# Altium project CAMA001AA-Project.PrjPCB (part 2 of 2)

## Sheet Power-V1_0.SchDoc
size A4; Organization: VAEngineering; Address1: Rechtstro 1 bus 2; Address2: 9185 Wachtebeke; Address3: Belgium; Revision: REV0; SheetNumber: 1; SheetTotal: 5
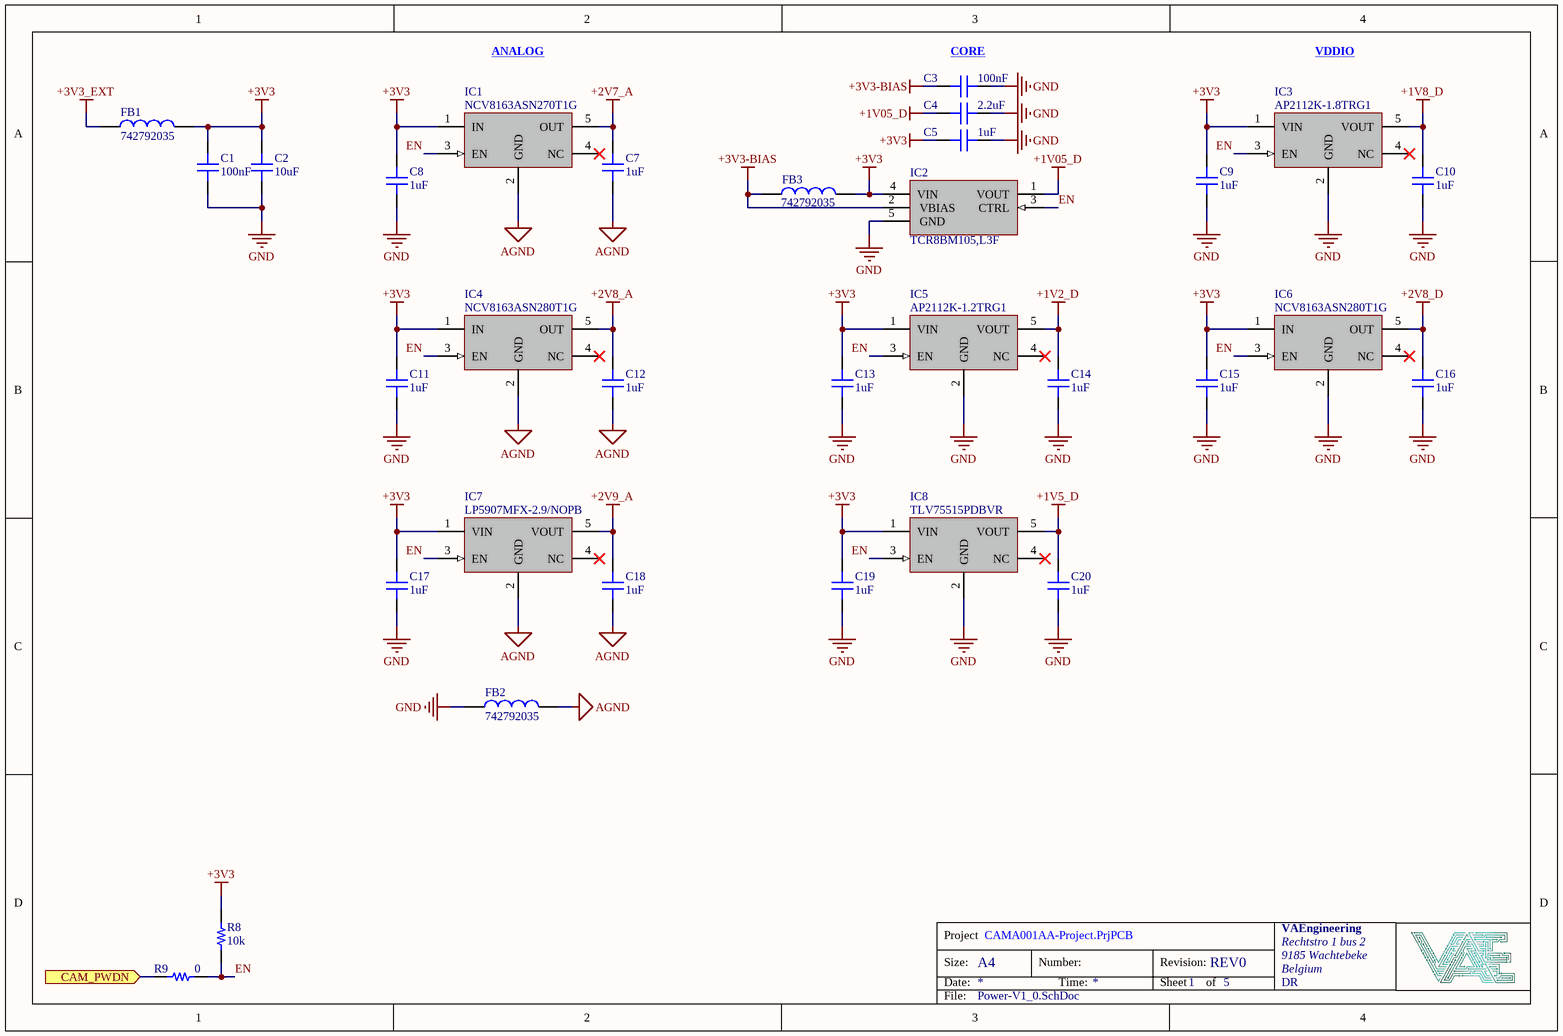
[diagram p1: Power-V1_0.SchDoc]

### Parts
C1  Capacitance: 100nF  [Esmart C0603]  (hidden comment: CL10B104KB8NNNL)
C2  Capacitance: 10uF  [ESmart C0805]  (hidden comment: CL21A106KOQNNWE)
C3  Capacitance: 100nF  [Esmart C0603]  (hidden comment: CL10B104KB8NNNL)
C4  Capacitance: 2.2uF  [ESMART C0603]  (hidden comment: LMK107B7225KA-TR)
C5  Capacitance: 1uF  [ESmart C0603 - Samsung]  (hidden comment: CL10A105KB8NNNC)
C7  Capacitance: 1uF  [ESmart C0603 - Samsung]  (hidden comment: CL10A105KB8NNNC)
C8  Capacitance: 1uF  [ESmart C0603 - Samsung]  (hidden comment: CL10A105KB8NNNC)
C9  Capacitance: 1uF  [ESmart C0603 - Samsung]  (hidden comment: CL10A105KB8NNNC)
C10  Capacitance: 1uF  [ESmart C0603 - Samsung]  (hidden comment: CL10A105KB8NNNC)
C11  Capacitance: 1uF  [ESmart C0603 - Samsung]  (hidden comment: CL10A105KB8NNNC)
C12  Capacitance: 1uF  [ESmart C0603 - Samsung]  (hidden comment: CL10A105KB8NNNC)
C13  Capacitance: 1uF  [ESmart C0603 - Samsung]  (hidden comment: CL10A105KB8NNNC)
C14  Capacitance: 1uF  [ESmart C0603 - Samsung]  (hidden comment: CL10A105KB8NNNC)
C15  Capacitance: 1uF  [ESmart C0603 - Samsung]  (hidden comment: CL10A105KB8NNNC)
C16  Capacitance: 1uF  [ESmart C0603 - Samsung]  (hidden comment: CL10A105KB8NNNC)
C17  Capacitance: 1uF  [ESmart C0603 - Samsung]  (hidden comment: CL10A105KB8NNNC)
C18  Capacitance: 1uF  [ESmart C0603 - Samsung]  (hidden comment: CL10A105KB8NNNC)
C19  Capacitance: 1uF  [ESmart C0603 - Samsung]  (hidden comment: CL10A105KB8NNNC)
C20  Capacitance: 1uF  [ESmart C0603 - Samsung]  (hidden comment: CL10A105KB8NNNC)
FB1  742792035  [Wurth WE-CBF_0805_High Speed]
FB2  742792035  [Wurth WE-CBF_0805_High Speed]
FB3  742792035  [Wurth WE-CBF_0805_High Speed]
IC1  NCV8163ASN270T1G  [ON Semi TSOP-5 / CASE 483 / ISSUE M]
IC2  TCR8BM105,L3F  [Toshiba DFN5B]
IC3  AP2112K-1.8TRG1  [DIODES SOT-25]
IC4  NCV8163ASN280T1G  [ON Semi TSOP-5 / CASE 483 / ISSUE M]
IC5  AP2112K-1.2TRG1  [DIODES SOT-23-5 W5]
IC6  NCV8163ASN280T1G  [ON Semi TSOP-5 / CASE 483 / ISSUE M]
IC7  LP5907MFX-2.9/NOPB  [TI SOT-23-5 / DBV0005A]
IC8  TLV75515PDBVR  [TI SOT-23-5 / DBV0005A]
R8  Resistance: 10k  [ESmart R0603]  (hidden comment: RMCF0603FT10K0)
R9  Resistance: 0  [ESmart R0603]  (hidden comment: RMCF0603ZT0R00)

### Ports
CAM_PWDN (in)

### Nets
+1V2_D: C14.1 IC5.5(VOUT)
+1V05_D: C4.1 IC2.1(VOUT)
+1V5_D: C20.1 IC8.5(VOUT)
+1V8_D: C10.1 IC3.5(VOUT)
+2V7_A: C7.1 IC1.5(OUT)
+2V8_A: C12.1 IC4.5(OUT)
+2V8_D: C16.1 IC6.5(OUT)
+2V9_A: C18.1 IC7.5(VOUT)
+3V3: C1.2 C2.2 C5.1 C8.1 C9.1 C11.1 C13.1 C15.1 C17.1 C19.1 FB1.1 FB3.1 IC1.1(IN) IC2.4(VIN) IC3.1(VIN) IC4.1(IN) IC5.1(VIN) IC6.1(IN) IC7.1(VIN) IC8.1(VIN) R8.1
+3V3-BIAS: C3.1 FB3.2 IC2.2(VBIAS)
+3V3_EXT: FB1.2
AGND: C7.2 C12.2 C18.2 FB2.2 IC1.2(GND) IC4.2(GND) IC7.2(GND)
GND: C1.1 C2.1 C3.2 C4.2 C5.2 C8.2 C9.2 C10.2 C11.2 C13.2 C14.2 C15.2 C16.2 C17.2 C19.2 C20.2 FB2.1 IC2.5(GND) IC3.2(GND) IC5.2(GND) IC6.2(GND) IC8.2(GND)
CAM_PWDN: R9.1 ; port CAM_PWDN
EN: IC1.3(EN) IC2.3(CTRL) IC3.3(EN) IC4.3(EN) IC5.3(EN) IC6.3(EN) IC7.3(EN) IC8.3(EN) R8.2 R9.2

Not connected (* = marked no-connect by the designer): IC1 4(NC)*; IC3 4(NC)*; IC4 4(NC)*; IC5 4(NC)*; IC6 4(NC)*; IC7 4(NC)*; IC8 4(NC)*

### Notes on the sheet
- ANALOG
- (near C3) CORE
- VDDIO
- Project
- Size:
- Date:
- A4
- Number:
- Time:
- Revision:
- Sheet
- of
- File:

### Library data of the parts
C1 C3 = Samsung CL10B104KB8NNNL: CL10 Series 0603 0.1 uF 50 V ±10% Tolerance X7R Multilayer Ceramic Capacitor; Voltage Rating: 50V; Supplier 1: Digi-Key; Manufacturer: Samsung; Manufacturer Part Number: CL10B104KB8NNNL; RoHS: Yes; Category: Ceramic Capacitors; Stock 1: 359524; Pricing 1: 1=0,10000, 10=0,02900, 50=0,01580, 100=0,01280, 500=0,00916, 1000=0,00720, 2500=0,00654, 5000=0,00602 (USD); Mount: Surface Mount; Case/Package: 0603; Min Operating Temperature: -55°C; Max Operating Temperature: 125°C; Tolerance: 10%; Dielectric: X7R; Packaging: Tape and Reel; Package Quantity: 15000; Voltage Rating (DC): 50V; Length: 1.6mm; Width: 0.031inch; Height: 0.8mm; Thickness: 0.035inch; Depth: 0.8mm; Radiation Hardening: No; ComponentLink1URL: https://datasheet.ciiva.com/26838/getdatasheetpartid-357523-26838415.pdf?src-supplier=Verical; ComponentLink1Description: https://datasheet.ciiva.com/26838/getdatasheetpartid-357523-26838415.pdf?src-supplier=Verical; ComponentLink2URL: https://datasheet.ciiva.com/25741/cl10b104kb8nnnl-25741341.pdf?src-supplier=Digi-Key; ComponentLink2Description: https://datasheet.ciiva.com/25741/cl10b104kb8nnnl-25741341.pdf?src-supplier=Digi-Key; Supplier 2: Digi-Key; Stock 2: 359524; Pricing 2: 1=0,10000, 10=0,02900, 50=0,01580, 100=0,01280, 500=0,00916, 1000=0,00720, 2500=0,00654, 5000=0,00602 (USD); Supplier 3: Digi-Key; Stock 3: 359524; Pricing 3: 15000=0,00524, 30000=0,00497, 75000=0,00445, 105000=0,00360, 150000=0,00348, 375000=0,00314 (USD); Supplier 4: Future Electronics; Stock 4: 1530651; Pricing 4: 1=0,09800, 1000=0,01180, 2500=0,00890, 5000=0,00720, 10000=0,00580 (USD); Supplier 5: Future Electronics; Stock 5: 1530000; Pricing 5: 15000=0,00370, 45000=0,00310, 75000=0,00310, 225000=0,00300, 375000=0,00300 (USD); Supplier 6: Avnet; Stock 6: 1008000; Pricing 6: 15000=0,00264, 30000=0,00261, 60000=0,00259, 90000=0,00257, 120000=0,00255 (USD); Supplier 7: Mouser; Stock 7: 480000; Pricing 7: 15000=0,00500, 45000=0,00500 (USD); Supplier 8: Arrow Electronics; Stock 8: 180000; Pricing 8: 15000=0,00350, 1=0,02810, 10=0,02460, 25=0,02430, 100=0,02310, 250=0,02280, 500=0,02250, 1000=0,01640, 3000=0,01480, 6000=0,01360, 15000=0,00950 (USD); Supplier 9: Digi-Key; Supplier 10: Future Electronics; Supplier 11: Future Electronics; Supplier Part Number 1: 1276-CL10B104KB8NNNLCT-ND; Supplier Part Number 2: 1276-CL10B104KB8NNNLDKR-ND; Supplier Part Number 3: 1276-CL10B104KB8NNNLTR-ND; Supplier Part Number 4: 3113240; Supplier Part Number 5: 1051215; Supplier Part Number 6: CL10B104KB8NNNL; Supplier Part Number 7: 187-CL10B104KB8NNNL; Supplier Part Number 8: CL10B104KB8NNNL; Supplier Part Number 9: CL10B104KB8NNNL-ND; Supplier Part Number 10: CL10B104KB8NNNL-REEL; Supplier Part Number 11: CL10B104KB8NNNL-CUTT
C2 = Sasmung CL21A106KOQNNWE: CAP CER 10UF 16V X5R 0805; Manufacturer: Samsung; Tolerance: 10%; Supplier 1: Digi-Key; Manufacturer Part Number: CL21A106KOQNNWE; RoHS: Yes; Category: Ceramic Capacitors; Stock 1: 76074; Pricing 1: 1=0,13000, 10=0,09300, 50=0,05280, 100=0,04370, 500=0,03064, 1000=0,02536 (USD); Mount: Surface Mount; Case/Package: 0805; Case Code (Metric): 2012; Case Code (Imperial): 0805; Min Operating Temperature: -55°C; Max Operating Temperature: 85°C; Package Quantity: 1; Packaging: Tape and Reel; Voltage Rating: 16V; Length: 0.079inch; Width: 0.049inch; Thickness: 0.055inch; ComponentLink1URL: https://datasheet.ciiva.com/25730/cl21a106koqnnwe-25730257.pdf?src-supplier=Digi-Key; ComponentLink1Description: https://datasheet.ciiva.com/25730/cl21a106koqnnwe-25730257.pdf?src-supplier=Digi-Key; Supplier 2: Digi-Key; Stock 2: 76074; Pricing 2: 1=0,13000, 10=0,09300, 50=0,05280, 100=0,04370, 500=0,03064, 1000=0,02536 (USD); Supplier 3: Digi-Key; Stock 3: 74000; Pricing 3: 2000=0,02360, 4000=0,02159, 10000=0,02009, 14000=0,01908, 50000=0,01657 (USD); Supplier 4: Mouser; Stock 4: 174000; Pricing 4: 1=0,14000, 10=0,10200, 100=0,04800, 500=0,03300, 1000=0,02700, 2000=0,02300, 10000=0,02000, 50000=0,01700 (USD); Supplier 5: Arrow Electronics; Stock 5: 7; Pricing 5: 1=0,08030 (USD); Supplier 6: Avnet; Pricing 6: 200000=0,01179, 204000=0,01162, 404000=0,01129, 1000000=0,01104, 2000000=0,01062 (USD); Supplier 7: Future Electronics; Pricing 7: 1=0,16700, 50=0,06610, 100=0,05610, 250=0,04520, 500=0,03840 (USD); Supplier 8: Future Electronics; Pricing 8: 2000=0,02900, 8000=0,01610, 20000=0,01510, 50000=0,01420, 80000=0,01380 (USD); Supplier 9: Future Electronics; Supplier 10: Future Electronics; Supplier Part Number 1: 1276-2894-1-ND; Supplier Part Number 2: 1276-2894-6-ND; Supplier Part Number 3: 1276-2894-2-ND; Supplier Part Number 4: 187-CL21A106KOQNNWE; Supplier Part Number 5: CL21A106KOQNNWE; Supplier Part Number 6: CL21A106KOQNNWE; Supplier Part Number 7: 4114733; Supplier Part Number 8: 5114029; Supplier Part Number 9: CL21A106KOQNNWE-CUTT; Supplier Part Number 10: CL21A106KOQNNWE-REEL
C4 = Taiyo Yuden LMK107B7225KA-TR: 0603 2.2 uF 10 V ±10 % Tolerance X7R Surface Mount Multilayer Ceramic Capacitor; Voltage Rating: 10V; Tolerance: 10%; Supplier 1: Digi-Key; Manufacturer: Taiyo Yuden; Manufacturer Part Number: LMK107B7225KA-TR; RoHS: Yes; Category: Ceramic Capacitors; Stock 1: 1165; Pricing 1: 1=0,20000, 10=0,13800, 50=0,08280, 100=0,06990, 500=0,04784, 1000=0,04232 (USD); Mount: Surface Mount; Case/Package: 0603; Min Operating Temperature: -55°C; Max Operating Temperature: 125°C; Packaging: Tape and Reel; Voltage Rating (DC): 10V; Dielectric: X7R; Termination: Wraparound; Length: 0.063inch; Width: 0.031inch; Thickness: 0.035inch; RoHS Compliant: Yes; Halogen Free: Halogen Free; ComponentLink1URL: http://www.yuden.co.jp/productdata/catalog/en/mlcc_all_e.pdf?src-supplier=Digi-Key; ComponentLink1Description: http://www.yuden.co.jp/productdata/catalog/en/mlcc_all_e.pdf?src-supplier=Digi-Key; ComponentLink2URL: https://www.yuden.co.jp/productdata/catalog/mlcc01_e.pdf?src-supplier=Digi-Key; ComponentLink2Description: https://www.yuden.co.jp/productdata/catalog/mlcc01_e.pdf?src-supplier=Digi-Key; ComponentLink3URL: http://www.yuden.co.jp/productdata/catalog/en/mlcc_all_e.pdf?src-supplier=Avnet+Asia; ComponentLink3Description: http://www.yuden.co.jp/productdata/catalog/en/mlcc_all_e.pdf?src-supplier=Avnet+Asia; Supplier 2: Digi-Key; Stock 2: 1165; Pricing 2: 1=0,20000, 10=0,13800, 50=0,08280, 100=0,06990, 500=0,04784, 1000=0,04232 (USD); Supplier 3: Newark; Stock 3: 60000; Pricing 3: 1=0,01900, 4000=0,01900, 8000=0,01900, 16000=0,01900, 24000=0,01900 (USD); Supplier 4: Newark; Stock 4: 8000; Pricing 4: 1=0,03600, 4000=0,03500, 8000=0,03300, 16000=0,02500, 24000=0,02300 (USD); Supplier 5: RSComponents; Stock 5: 1; Pricing 5: 4000=0,03800 (USD); Supplier 6: Avnet; Stock 6: 8000; Pricing 6: 4000=0,03472, 8000=0,03280, 16000=0,03088, 24000=0,02082, 32000=0,01944, 40000=0,01806, 400000=0,01450 (USD); Supplier 7: Future Electronics; Stock 7: 4000; Pricing 7: 4000=0,06000 (USD); Supplier 8: Newark; Pricing 8: 1=0,22000, 25=0,15200, 50=0,11400, 100=0,07600, 250=0,06400, 500=0,05200, 4000=0,05200 (USD); Supplier 9: Avnet; Pricing 9: 4000=0,03400, 8000=0,03300, 16000=0,02500, 24000=0,02300 (USD); Supplier 10: Mouser; Pricing 10: 1=0,18000, 10=0,11600, 50=0,11600, 100=0,06700, 500=0,04800, 1000=0,04300, 4000=0,03500, 8000=0,03300, 10000=0,03300 (USD); Supplier 11: Digi-Key; Pricing 11: 4000=0,03680 (USD); Supplier 12: RSComponents; Supplier 13: RSComponents; Supplier 14: Arrow Electronics; Supplier 15: Digi-Key; Supplier Part Number 1: 587-5914-1-ND; Supplier Part Number 2: 587-5914-6-ND; Supplier Part Number 3: 68X1539; Supplier Part Number 4: 79AH3598; Supplier Part Number 5: 1843193; Supplier Part Number 6: LMK107B7225KA-TR; Supplier Part Number 7: 2054571; Supplier Part Number 8: 02AH5379; Supplier Part Number 9: 68X1539; Supplier Part Number 10: 963-LMK107B7225KA-TR; Supplier Part Number 11: 587-5914-2-ND; Supplier Part Number 12: 1843774; Supplier Part Number 13: 1843774P; Supplier Part Number 14: LMK107B7225KA-TR**MULT1; Supplier Part Number 15: LMK107B7225KA-TR-ND
C5 C7-C20 = Samsung CL10A105KB8NNNC: Cap Ceramic 1uF 50V X5R 10% SMD 0603 85C Cardboard T/R; Supplier 1: Digi-Key; Manufacturer: Samsung; Manufacturer Part Number: CL10A105KB8NNNC; RoHS: Yes; Category: Ceramic Capacitors; Stock 1: 1933508; Pricing 1: 1=0,16000, 10=0,11500, 50=0,06560, 100=0,05430, 500=0,03808, 1000=0,03152 (USD); Mount: Surface Mount; Case/Package: 0603; Case Code (Imperial): 0603; Case Code (Metric): 1608; Contact Plating: Tin; Min Operating Temperature: -55°C; Max Operating Temperature: 85°C; Package Quantity: 1; Packaging: Tape and Reel; Tolerance: 10%; Voltage Rating: 50V; Dielectric: X5R; Termination: Wraparound; Length: 1.6mm; Width: 0.031inch; Thickness: 0.035inch; Depth: 0.8mm; Radiation Hardening: No; ComponentLink1URL: https://datasheet.ciiva.com/26877/getdatasheetpartid-753736-26877879.pdf?src-supplier=Verical; ComponentLink1Description: https://datasheet.ciiva.com/26877/getdatasheetpartid-753736-26877879.pdf?src-supplier=Verical; Supplier 2: Digi-Key; Stock 2: 1933508; Pricing 2: 1=0,16000, 10=0,11500, 50=0,06560, 100=0,05430, 500=0,03808, 1000=0,03152 (USD); Supplier 3: Digi-Key; Stock 3: 1933508; Pricing 3: 4000=0,02441, 8000=0,02270, 12000=0,02157, 28000=0,02043, 100000=0,01547 (USD); Supplier 4: Newark; Stock 4: 132000; Pricing 4: 1=0,02600, 4000=0,02500, 8000=0,02400, 16000=0,02300 (USD); Supplier 5: Newark; Stock 5: 4312; Pricing 5: 1=0,19200, 25=0,13800, 50=0,07800, 100=0,06500, 250=0,05500, 500=0,04600, 1000=0,03700 (USD); Supplier 6: Avnet; Stock 6: 116000; Pricing 6: 4000=0,02554, 8000=0,02298, 16000=0,02158, 24000=0,02155, 32000=0,02055 (USD); Supplier 7: Future Electronics; Stock 7: 45790; Pricing 7: 1=0,16700, 50=0,06930, 100=0,05930, 500=0,04130, 1500=0,03230 (USD); Supplier 8: Future Electronics; Stock 8: 44000; Pricing 8: 4000=0,02140, 12000=0,01780, 20000=0,01760, 40000=0,01730, 80000=0,01710 (USD); Supplier 9: Arrow Electronics; Stock 9: 8000; Pricing 9: 4000=0,02400, 8000=0,02240, 12000=0,02050, 28000=0,01910, 100000=0,01640, 1=0,10010 (USD); Supplier 10: Mouser; Stock 10: 218690; Pricing 10: 1=0,16000, 10=0,11500, 100=0,05400, 500=0,03800, 1000=0,03100, 2500=0,02400, 8000=0,02100, 24000=0,02000 (USD); Supplier 11: Farnell; Stock 11: 19232; Pricing 11: 10=0,06830, 100=0,05540, 500=0,03430, 1000=0,02560, 2000=0,02160, 4000=0,01750, 20000=0,01490 (GBP); Supplier 12: Farnell; Pricing 12: 150=0,05540, 500=0,03430, 1000=0,02560, 2000=0,02160, 4000=0,01750, 20000=0,01490 (GBP); Supplier 13: Farnell; Pricing 13: 4000=0,01750, 20000=0,01600 (GBP); Supplier 14: Newark; Supplier 15: Farnell; Supplier 16: Future Electronics; Supplier 17: Future Electronics; Supplier Part Number 1: 1276-1860-1-ND; Supplier Part Number 2: 1276-1860-6-ND; Supplier Part Number 3: 1276-1860-2-ND; Supplier Part Number 4: 82AC9278; Supplier Part Number 5: 82AC9277; Supplier Part Number 6: CL10A105KB8NNNC; Supplier Part Number 7: 1025631; Supplier Part Number 8: 7019721; Supplier Part Number 9: CL10A105KB8NNNC; Supplier Part Number 10: 187-CL10A105KB8NNNC; Supplier Part Number 11: 3013383; Supplier Part Number 12: 3013383RL; Supplier Part Number 13: 3010057; Supplier Part Number 14: 42AH1669; Supplier Part Number 15: 2988817; Supplier Part Number 16: CL10A105KB8NNNC-CUTT; Supplier Part Number 17: CL10A105KB8NNNC-REEL
FB1-FB3 = Wurth 742792035: Ferrite Beads WE-CBF 0805 220MHz 300Ohm 300mA; Manufacturer: Wurth Electronics; Resistance: 300mR; Tolerance: 25%; Impedance: 300R; Number of Lines: 1; Inductance: 470nH; Manufacturer Part Number: 742792035; RoHS: Yes; Category: Ferrite Beads and Chips; Stock 1: 8037; Pricing 1: 1=0,20000, 50=0,19600, 100=0,18000, 500=0,17200, 1000=0,16500, 2000=0,15700 (USD); Mount: Surface Mount; Case/Package: SMD/SMT; Core Material: Ferrite; Case Code (Metric): 2012; Case Code (Imperial): 0805; Weight: 0.000194oz; Material: Ferrite; Min Operating Temperature: -55°C; Max Operating Temperature: 125°C; Package Quantity: 4000; Packaging: Tape and Reel; Current Rating: 300mA; Max Current Rating: 300mA; DC Resistance (DCR): 300mR; Max DC Current: 300mA; Termination: SMD/SMT; Test Frequency: 220MHz; Series: WE-CBF; Length: 2mm; Width: 0.047inch; Height: 0.9mm; Depth: 1.2mm; REACH SVHC: Unknown; RoHS Compliant: Yes; ComponentLink1URL: https://datasheet.ciiva.com/1474/1696023-1474913.pdf?src-supplier=Farnell; ComponentLink1Description: https://datasheet.ciiva.com/1474/1696023-1474913.pdf?src-supplier=Farnell; ComponentLink2URL: https://datasheet.ciiva.com/23762/742792035-23762913.pdf?src-supplier=Newark; ComponentLink2Description: https://datasheet.ciiva.com/23762/742792035-23762913.pdf?src-supplier=Newark; ComponentLink3URL: https://datasheet.ciiva.com/11803/0900766b80d2dd7e-11803674.pdf?src-supplier=RSComponents; ComponentLink3Description: https://datasheet.ciiva.com/11803/0900766b80d2dd7e-11803674.pdf?src-supplier=RSComponents; ComponentLink4URL: https://datasheet.ciiva.com/1126/1696023-1126566.pdf?src-supplier=Element14; ComponentLink4Description: https://datasheet.ciiva.com/1126/1696023-1126566.pdf?src-supplier=Element14; ComponentLink5URL: https://datasheet.ciiva.com/29363/742792035-29363979.pdf?src-supplier=Digi-Key; ComponentLink5Description: https://datasheet.ciiva.com/29363/742792035-29363979.pdf?src-supplier=Digi-Key; ComponentLink6URL: https://datasheet.ciiva.com/14122/742792035-eng-tds-14122796.pdf?src-supplier=Distrelec; ComponentLink6Description: https://datasheet.ciiva.com/14122/742792035-eng-tds-14122796.pdf?src-supplier=Distrelec; ComponentLink7URL: https://datasheet.ciiva.com/29363/742792035-29363981.pdf?src-supplier=Digi-Key; ComponentLink7Description: https://datasheet.ciiva.com/29363/742792035-29363981.pdf?src-supplier=Digi-Key; Supplier 1: Digi-Key; Supplier 2: Digi-Key; Supplier 3: Digi-Key; Supplier 4: Mouser; Supplier 5: Farnell; Supplier 6: Farnell; Supplier 7: Farnell; Supplier 8: Newark; Supplier 9: Newark; Supplier 10: RSComponents; Supplier 11: RSComponents; Supplier 12: RSComponents; Supplier 13: Allied Electronics; Supplier Part Number 1: 732-4640-1-ND; Supplier Part Number 2: 732-4640-6-ND; Supplier Part Number 3: 732-4640-2-ND; Supplier Part Number 4: 710-742792035; Supplier Part Number 5: 1635715; Supplier Part Number 6: 1635715RL; Supplier Part Number 7: 2761562; Supplier Part Number 8: 08P2368; Supplier Part Number 9: 24AC5587; Supplier Part Number 10: 1633535; Supplier Part Number 11: 6694068; Supplier Part Number 12: 6694068P; Supplier Part Number 13: 70996351
IC1 = ON Semi NCV8163ASN270T1G: LDO Regulator Pos 2.7V 0.25A Automotive 5-Pin TSOP T/R; Manufacturer: ON Semiconductor; Supplier 1: Avnet; Manufacturer Part Number: NCV8163ASN270T1G; RoHS: Yes; Category: Voltage Regulators - Linear; Stock 1: 108000; Pricing 1: 1225=0,30207, 1300=0,2939, 2500=0,28574, 6200=0,27758, 13000=0,26941, 62000=0,26125, 130000=0,25308 (USD); RoHS Compliant: Yes; ComponentLink1URL: http://www.onsemi.com/pub/Collateral/NCV8163-D.PDF?src-supplier=Digi-Key; ComponentLink1Description: http://www.onsemi.com/pub/Collateral/NCV8163-D.PDF?src-supplier=Digi-Key; Supplier 2: Digi-Key; Stock 2: 5448; Pricing 2: 1=0,77, 10=0,68, 25=0,6392, 100=0,4844, 250=0,41228, 500=0,39166, 1000=0,2989 (USD); Supplier 3: Digi-Key; Stock 3: 5448; Pricing 3: 1=0,77, 10=0,68, 25=0,6392, 100=0,4844, 250=0,41228, 500=0,39166, 1000=0,2989 (USD); Supplier 4: Digi-Key; Stock 4: 3000; Pricing 4: 3000=0,27829, 6000=0,26798, 15000=0,25768, 30000=0,25355 (USD); Supplier 5: Mouser; Stock 5: 2985; Pricing 5: 1=0,77, 10=0,64, 50=0,64, 100=0,413, 1000=0,299, 10000=0,257 (USD); Supplier 6: Heisener; Stock 6: 5253; Pricing 6: 1=0,3356 (USD); Supplier Part Number 1: NCV8163ASN270T1G; Supplier Part Number 2: 488-NCV8163ASN270T1GCT-ND; Supplier Part Number 3: 488-NCV8163ASN270T1GDKR-ND; Supplier Part Number 4: 488-NCV8163ASN270T1GTR-ND; Supplier Part Number 5: 863-NCV8163ASN270T1G; Supplier Part Number 6: NCV8163ASN270T1G
IC2 = Toshiba TCR8BM105,L3F: Low Drop-Out Regulator Positive 1.05V 800mA 5-Pin DFN-B; Supplier 1: Mouser; Manufacturer: Toshiba; Manufacturer Part Number: TCR8BM105,L3F; RoHS: No; Category: Uncategorized; Stock 1: 4989; Pricing 1: 1=0,45000, 10=0,36100, 50=0,36100, 100=0,26800, 1000=0,17600, 10000=0,14800 (USD); Supplier 2: Digi-Key; Stock 2: 4994; Pricing 2: 1=0,45000, 10=0,38600, 25=0,36040, 100=0,28840, 250=0,26780, 500=0,22660, 1000=0,17510, 2500=0,15965 (USD); Supplier 3: Digi-Key; Stock 3: 5000; Pricing 3: 5000=0,15831 (USD); Supplier 4: Avnet; Pricing 4: 5000=0,15759, 10000=0,15347, 20000=0,14626, 30000=0,14214, 40000=0,13905, 50000=0,13493, 500000=0,13184 (USD); Supplier Part Number 1: 757-TCR8BM105L3F; Supplier Part Number 2: TCR8BM105L3FCT-ND; Supplier Part Number 3: TCR8BM105L3FTR-ND; Supplier Part Number 4: TCR8BM105,L3F
IC3 = Diodes AP2112K-1.8TRG1: LDO Regulator Pos 1.8V 0.6A 5-Pin SOT-23 T/R; Manufacturer: Diodes; Dropout Voltage: 500mV; Number of Outputs: 1; Min Input Voltage: 2.5V; Max Input Voltage: 6V; Output Current: 600mA; Polarity: Positive; Quiescent Current: 80uA; Accuracy: 1.5%; Output Type: Fixed; Supplier 1: Arrow Electronics; Manufacturer Part Number: AP2112K-1.8TRG1; RoHS: Yes; Category: Voltage Regulators - Linear; Stock 1: 1950; Pricing 1: 1=0,35440, 10=0,28930, 25=0,27230, 100=0,19230, 250=0,17660, 500=0,14510, 1000=0,10860 (USD); Mount: Surface Mount; Case/Package: SOT-23-5; Number of Pins: 5; Min Operating Temperature: -40°C; Max Operating Temperature: 85°C; Package Quantity: 3000; Packaging: Tape and Reel; Output Voltage: 1.8V; Number of Regulators: 1; Max Output Current: 600mA; Length: 3.1mm; Width: 1.7mm; Height: 1.3mm; RoHS Compliant: Yes; ComponentLink1URL: https://datasheet.ciiva.com/30016/ap2112-30016791.pdf?src-supplier=Avnet; ComponentLink1Description: https://datasheet.ciiva.com/30016/ap2112-30016791.pdf?src-supplier=Avnet; ComponentLink2URL: https://datasheet.ciiva.com/29569/ap2112-29569045.pdf?src-supplier=Digi-Key; ComponentLink2Description: https://datasheet.ciiva.com/29569/ap2112-29569045.pdf?src-supplier=Digi-Key; ComponentLink3URL: https://datasheet.ciiva.com/29569/ap2112-29569046.pdf?src-supplier=Digi-Key; ComponentLink3Description: https://datasheet.ciiva.com/29569/ap2112-29569046.pdf?src-supplier=Digi-Key; ComponentLink4URL: https://datasheet.ciiva.com/29569/ap2112-29569047.pdf?src-supplier=Digi-Key; ComponentLink4Description: https://datasheet.ciiva.com/29569/ap2112-29569047.pdf?src-supplier=Digi-Key; Supplier 2: Newark; Stock 2: 2775; Pricing 2: 5=0,37000, 10=0,30100, 25=0,27500, 50=0,24000, 100=0,20500, 250=0,18600, 500=0,15300, 1000=0,11500 (USD); Supplier 3: Mouser; Stock 3: 1407; Pricing 3: 1=0,37000, 10=0,30200, 50=0,30200, 100=0,18600, 1000=0,11600, 10000=0,09200 (USD); Supplier 4: Digi-Key; Stock 4: 54271; Pricing 4: 1=0,37000, 10=0,30100, 25=0,27560, 100=0,20520, 250=0,18596, 500=0,15392, 1000=0,11543 (USD); Supplier 5: Digi-Key; Stock 5: 54271; Pricing 5: 1=0,37000, 10=0,30100, 25=0,27560, 100=0,20520, 250=0,18596, 500=0,15392, 1000=0,11543 (USD); Supplier 6: Digi-Key; Stock 6: 54000; Pricing 6: 3000=0,10581, 6000=0,09940, 15000=0,09299, 30000=0,09075 (USD); Supplier 7: Avnet; Pricing 7: 3000=0,07384, 6000=0,07119, 12000=0,06905, 18000=0,06703, 24000=0,06451, 30000=0,06350, 300000=0,06250 (USD); Supplier 8: Future Electronics; Pricing 8: 3000=0,11700, 9000=0,11400, 15000=0,11200, 45000=0,10900, 75000=0,10700 (USD); Supplier 9: Farnell; Stock 9: 2775; Pricing 9: 5=0,41400, 10=0,33800, 100=0,20700, 500=0,17200 (GBP); Supplier 10: Farnell; Stock 10: 2775; Pricing 10: 100=0,20700, 500=0,17200 (GBP); Supplier 11: Allied Electronics; Supplier 12: Future Electronics; Supplier 13: RSComponents; Supplier 14: RSComponents; Supplier 15: RSComponents; Supplier Part Number 1: AP2112K-1.8TRG1; Supplier Part Number 2: 76AH4595; Supplier Part Number 3: 621-AP2112K-1.8TRG1; Supplier Part Number 4: AP2112K-1.8TRG1DICT-ND; Supplier Part Number 5: AP2112K-1.8TRG1DIDKR-ND; Supplier Part Number 6: AP2112K-1.8TRG1DITR-ND; Supplier Part Number 7: AP2112K-1.8TRG1; Supplier Part Number 8: 8050397; Supplier Part Number 9: 3482764; Supplier Part Number 10: 3482764RL; Supplier Part Number 11: 70550982; Supplier Part Number 12: AP2112K-1.8TRG1-REEL; Supplier Part Number 13: 1223348; Supplier Part Number 14: 8283506; Supplier Part Number 15: 8283506P
IC4 IC6 = ON Semi NCV8163ASN280T1G: LDO Regulator Pos 2.8V 0.25A Automotive 5-Pin TSOP T/R; Manufacturer: ON Semiconductor; Supplier 1: Arrow Electronics; Manufacturer Part Number: NCV8163ASN280T1G; RoHS: Yes; Category: Voltage Regulators - Linear; Stock 1: 6000; Pricing 1: 3000=0,2065, 9000=0,1966, 24000=0,1955, 45000=0,1905 (USD); ComponentLink1URL: http://www.onsemi.com/pub/Collateral/NCV8163-D.PDF?src-supplier=Digi-Key; ComponentLink1Description: http://www.onsemi.com/pub/Collateral/NCV8163-D.PDF?src-supplier=Digi-Key; ComponentLink2URL: https://datasheet.octopart.com/NCV8163ASN280T1G-ON-Semiconductor-datasheet-139012533.pdf?src-supplier=Future+Electronics; ComponentLink2Description: https://datasheet.octopart.com/NCV8163ASN280T1G-ON-Semiconductor-datasheet-139012533.pdf?src-supplier=Future+Electronics; Supplier 2: Digi-Key; Stock 2: 8670; Pricing 2: 1=0,59, 10=0,521, 25=0,4896, 100=0,3712, 250=0,31592, 500=0,30014, 1000=0,22905 (USD); Supplier 3: Digi-Key; Stock 3: 8670; Pricing 3: 1=0,59, 10=0,521, 25=0,4896, 100=0,3712, 250=0,31592, 500=0,30014, 1000=0,22905 (USD); Supplier 4: Digi-Key; Stock 4: 6000; Pricing 4: 3000=0,21325, 6000=0,20535, 15000=0,19745, 30000=0,1943 (USD); Supplier 5: Farnell; Stock 5: 2990; Pricing 5: 1=0,163 (EUR); Supplier 6: Farnell; Stock 6: 2990; Pricing 6: 100=0,163 (EUR); Supplier 7: Mouser; Stock 7: 8905; Pricing 7: 1=0,42, 10=0,359, 50=0,359, 100=0,263, 1000=0,218, 10000=0,197 (USD); Supplier 8: Rs; Pricing 8: 105=0,284, 1005=0,21, 3000=0,193, 9000=0,189 (EUR); Supplier 9: Rs; Pricing 9: 15=0,473, 105=0,284, 1005=0,21, 3000=0,193, 9000=0,189 (EUR); Supplier 10: Rs; Pricing 10: 3000=0,208 (EUR); Supplier 11: Future Electronics; Pricing 11: 3000=0,21, 6000=0,205, 12000=0,2, 15000=0,2, 45000=0,193 (USD); Supplier 12: Avnet; Pricing 12: 6000=0,23147, 12000=0,22522, 18000=0,21896, 30000=0,2127, 60000=0,20645, 300000=0,20019, 600000=0,19394 (USD); Supplier 13: Newark; Stock 13: 2990; Pricing 13: 1=0,602, 10=0,531, 25=0,499, 50=0,439, 100=0,378, 250=0,321, 500=0,306, 1000=0,234 (USD); Supplier 14: Heisener; Stock 14: 5425; Pricing 14: 1=0,6483 (USD); Supplier Part Number 1: NCV8163ASN280T1G; Supplier Part Number 2: NCV8163ASN280T1GOSCT-ND; Supplier Part Number 3: NCV8163ASN280T1GOSDKR-ND; Supplier Part Number 4: NCV8163ASN280T1GOSTR-ND; Supplier Part Number 5: 2981199; Supplier Part Number 6: 2981199RL; Supplier Part Number 7: 863-NCV8163ASN280T1G; Supplier Part Number 8: 1858827P; Supplier Part Number 9: 1858827; Supplier Part Number 10: 1858116; Supplier Part Number 11: 6107929; Supplier Part Number 12: NCV8163ASN280T1G; Supplier Part Number 13: 84AC7270; Supplier Part Number 14: NCV8163ASN280T1G
IC5 = Diodes AP2112K-1.2TRG1: LDO Regulator Pos 1.2V 0.6A 5-Pin SOT-23 T/R; Manufacturer: Diodes; Supplier 1: Digi-Key; Manufacturer Part Number: AP2112K-1.2TRG1; RoHS: Yes; Category: Voltage Regulators - Linear; Stock 1: 3000; Pricing 1: 1=0,35, 10=0,287, 25=0,2628, 100=0,1955, 250=0,1772, 500=0,14666, 1000=0,10999 (USD); ComponentLink1URL: https://datasheet.ciiva.com/30016/ap2112-30016790.pdf?src-supplier=Avnet; ComponentLink1Description: https://datasheet.ciiva.com/30016/ap2112-30016790.pdf?src-supplier=Avnet; ComponentLink2URL: https://datasheet.ciiva.com/29568/ap2112-29568630.pdf?src-supplier=Digi-Key; ComponentLink2Description: https://datasheet.ciiva.com/29568/ap2112-29568630.pdf?src-supplier=Digi-Key; Supplier 2: Digi-Key; Stock 2: 3000; Pricing 2: 1=0,35, 10=0,287, 25=0,2628, 100=0,1955, 250=0,1772, 500=0,14666, 1000=0,10999 (USD); Supplier 3: Digi-Key; Stock 3: 3000; Pricing 3: 3000=0,10082, 6000=0,09471, 15000=0,0886, 30000=0,08127, 75000=0,07821 (USD); Supplier 4: Farnell; Stock 4: 3000; Pricing 4: 5=0,393, 10=0,315, 100=0,173, 500=0,143, 1000=0,107, 3000=0,0978, 6000=0,0855, 12000=0,0837 (EUR); Supplier 5: Farnell; Stock 5: 3000; Pricing 5: 100=0,173, 500=0,143, 1000=0,107, 3000=0,0978, 6000=0,0855, 12000=0,0837 (EUR); Supplier 6: Mouser; Stock 6: 3603; Pricing 6: 1=0,35, 10=0,285, 50=0,285, 100=0,194, 1000=0,109, 10000=0,087 (USD); Supplier 7: Avnet; Pricing 7: 3000=0,07384, 6000=0,07119, 12000=0,06905, 18000=0,06703, 24000=0,06451, 30000=0,0635, 300000=0,0625 (USD); Supplier 8: Future Electronics; Pricing 8: 3000=0,0807, 9000=0,0777, 15000=0,0764, 60000=0,0728, 90000=0,0706 (USD); Supplier 9: Newark; Stock 9: 3000; Pricing 9: 1=0,377, 5=0,377, 10=0,308, 25=0,268, 50=0,23, 100=0,19, 250=0,173, 500=0,157, 1000=0,118 (USD); Supplier 10: Heisener; Stock 10: 251470; Pricing 10: 1=0,1109 (USD); Supplier Part Number 1: 31-AP2112K-1.2TRG1CT-ND; Supplier Part Number 2: 31-AP2112K-1.2TRG1DKR-ND; Supplier Part Number 3: 31-AP2112K-1.2TRG1TR-ND; Supplier Part Number 4: 3942373; Supplier Part Number 5: 3942373RL; Supplier Part Number 6: 621-AP2112K-1.2TRG1; Supplier Part Number 7: AP2112K-1.2TRG1; Supplier Part Number 8: 3106628; Supplier Part Number 9: 28AK5647; Supplier Part Number 10: AP2112K-1.2TRG1
IC7 = TI LP5907MFX-2.9/NOPB: LDO Regulator Pos 2.9V 0.25A 5-Pin SOT-23 T/R; Manufacturer: Texas Instruments; Supplier 1: Mouser; Manufacturer Part Number: LP5907MFX-2.9/NOPB; RoHS: Yes; Category: Voltage Regulators - Linear; Stock 1: 5460; Pricing 1: 1=0,42, 10=0,344, 50=0,344, 100=0,277, 1000=0,216, 10000=0,194 (USD); ComponentLink1URL: https://media.digikey.com/pdf/Data%20Sheets/Texas%20Instruments%20PDFs/ConnectedSensorAutoSystemsGuide.pdf?src-supplier=Digi-Key; ComponentLink1Description: https://media.digikey.com/pdf/Data%20Sheets/Texas%20Instruments%20PDFs/ConnectedSensorAutoSystemsGuide.pdf?src-supplier=Digi-Key; ComponentLink2URL: http://www.ti.com/general/docs/suppproductinfo.tsp?distId=10&amp;gotoUrl=http%3A%2F%2Fwww.ti.com%2Flit%2Fgpn%2Flp5907&src-supplier=Digi-Key; ComponentLink2Description: http://www.ti.com/general/docs/suppproductinfo.tsp?distId=10&amp;gotoUrl=http%3A%2F%2Fwww.ti.com%2Flit%2Fgpn%2Flp5907&src-supplier=Digi-Key; Supplier 2: Arrow Electronics; Stock 2: 477; Pricing 2: 1=0,1963, 10=0,1883, 25=0,1864, 100=0,1763, 250=0,1745 (USD); Supplier 3: Digi-Key; Stock 3: 4653; Pricing 3: 1=0,66, 10=0,564, 25=0,5268, 100=0,4214, 250=0,39128, 500=0,33108, 1000=0,25583 (USD); Supplier 4: Digi-Key; Stock 4: 4653; Pricing 4: 1=0,66, 10=0,564, 25=0,5268, 100=0,4214, 250=0,39128, 500=0,33108, 1000=0,25583 (USD); Supplier 5: Digi-Key; Stock 5: 3000; Pricing 5: 3000=0,23326, 6000=0,21821, 15000=0,20316, 30000=0,19263 (USD); Supplier 6: Heisener; Stock 6: 3895; Pricing 6: 1=0,6293 (USD); Supplier Part Number 1: 595-LP5907MFX2.9NOPB; Supplier Part Number 2: LP5907MFX-2.9/NOPB; Supplier Part Number 3: 296-47488-1-ND; Supplier Part Number 4: 296-47488-6-ND; Supplier Part Number 5: 296-47488-2-ND; Supplier Part Number 6: LP5907MFX-2.9/NOPB
IC8 = TI TLV75515PDBVR: 500-mA, high-PSRR, low-IQ, low-dropout voltage regulator with enable 5-SOT-23 -40 to 125; Manufacturer: Texas Instruments; Supplier 1: Mouser; Manufacturer Part Number: TLV75515PDBVR; RoHS: Yes; Category: Integrated Circuits (ICs); Stock 1: 7308; Pricing 1: 1=0,34, 10=0,279, 50=0,279, 100=0,211, 1000=0,147, 10000=0,109 (USD); ComponentLink1URL: http://www.ti.com/general/docs/suppproductinfo.tsp?distId=10&amp;gotoUrl=http%3A%2F%2Fwww.ti.com%2Flit%2Fgpn%2Ftlv755p&src-supplier=Digi-Key; ComponentLink1Description: http://www.ti.com/general/docs/suppproductinfo.tsp?distId=10&amp;gotoUrl=http%3A%2F%2Fwww.ti.com%2Flit%2Fgpn%2Ftlv755p&src-supplier=Digi-Key; Supplier 2: Arrow Electronics; Stock 2: 2535; Pricing 2: 1=0,2113, 10=0,1935, 25=0,1918, 100=0,1665, 250=0,1629, 500=0,1534, 1000=0,1339 (USD); Supplier 3: Digi-Key; Stock 3: 12565; Pricing 3: 1=0,44, 10=0,375, 25=0,35, 100=0,28, 250=0,25996, 500=0,21998, 1000=0,16998 (USD); Supplier 4: Digi-Key; Stock 4: 12565; Pricing 4: 1=0,44, 10=0,375, 25=0,35, 100=0,28, 250=0,25996, 500=0,21998, 1000=0,16998 (USD); Supplier 5: Digi-Key; Stock 5: 6000; Pricing 5: 3000=0,15498, 6000=0,14499, 15000=0,13499, 30000=0,12799, 75000=0,12499 (USD); Supplier 6: Heisener; Stock 6: 4417; Pricing 6: 1=0,3679 (USD); Supplier Part Number 1: 595-TLV75515PDBVR; Supplier Part Number 2: TLV75515PDBVR; Supplier Part Number 3: 296-51787-1-ND; Supplier Part Number 4: 296-51787-6-ND; Supplier Part Number 5: 296-51787-2-ND; Supplier Part Number 6: TLV75515PDBVR
R8 = Stackpole RMCF0603FT10K0: Res Thick Film 0603 10K Ohm 1% 0.1W(1/10W) ±100ppm/C Molded SMD Automotive T/R; Manufacturer: Stackpole Electronics; Power Rating: 100mW; Temperature Coefficient: 100ppm/°C; Supplier 1: Digi-Key; Manufacturer Part Number: RMCF0603FT10K0; RoHS: Yes; Category: Chip SMD Resistors; Stock 1: 1019094; Pricing 1: 1=0,10000, 10=0,01500, 100=0,00590, 1000=0,00265, 2500=0,00230 (USD); Mount: Surface Mount; Case/Package: 0603; Case Code (Metric): 1608; Case Code (Imperial): 0603; Contact Plating: Tin,Matte; Min Operating Temperature: -55°C; Max Operating Temperature: 155°C; Tolerance: 1%; Packaging: Tape and Reel; Resistor Type: Thick Film; Number of Terminations: 2; Max Power Dissipation: 100mW; Features: Automotive AEC-Q200; Length: 1.55mm; Width: 0.031inch; Height: 0.022inch; Depth: 0.8mm; Radiation Hardening: No; Military Standard: Not; Lead Free: Lead Free; ComponentLink1URL: http://components.arrow.com/part/dataview/43747082S6756917N1174?src-supplier=Arrow+Electronics; ComponentLink1Description: http://components.arrow.com/part/dataview/43747082S6756917N1174?src-supplier=Arrow+Electronics; ComponentLink2URL: https://www.seielect.com/catalog/sei-rmcf_rmcp.pdf?src-supplier=Digi-Key; ComponentLink2Description: https://www.seielect.com/catalog/sei-rmcf_rmcp.pdf?src-supplier=Digi-Key; ComponentLink3URL: https://www.seielect.com/catalog/SEI-RMCF_RMCP.pdf?src-supplier=Avnet; ComponentLink3Description: https://www.seielect.com/catalog/SEI-RMCF_RMCP.pdf?src-supplier=Avnet; ComponentLink4URL: http://www.seielect.com/catalog/sei-rmc.pdf?src-supplier=Future+Electronics; ComponentLink4Description: http://www.seielect.com/catalog/sei-rmc.pdf?src-supplier=Future+Electronics; ComponentLink5URL: https://www.verical.com/server-webapp/html/getDatasheet?partID=360913&src-supplier=Verical; ComponentLink5Description: https://www.verical.com/server-webapp/html/getDatasheet?partID=360913&src-supplier=Verical; Supplier 2: Digi-Key; Stock 2: 1019094; Pricing 2: 1=0,10000, 10=0,01500, 100=0,00590, 1000=0,00265, 2500=0,00230 (USD); Supplier 3: Digi-Key; Stock 3: 1018900; Pricing 3: 5000=0,00190, 10000=0,00165, 25000=0,00145, 50000=0,00136 (USD); Supplier 4: Newark; Stock 4: 65000; Pricing 4: 5000=0,00300, 20000=0,00300, 30000=0,00300 (USD); Supplier 5: Avnet; Stock 5: 65000; Pricing 5: 5000=0,01889, 10000=0,01887, 20000=0,01884, 30000=0,01882, 40000=0,01879 (USD); Supplier 6: Future Electronics; Stock 6: 65964; Pricing 6: 1=0,00810, 50=0,00520, 100=0,00480, 500=0,00400, 1500=0,00350 (USD); Supplier 7: Arrow Electronics; Stock 7: 315000; Pricing 7: 5000=0,00190, 1=0,02060 (USD); Supplier 8: Future Electronics; Pricing 8: 5000=0,00280, 20000=0,00230, 75000=0,00230, 200000=0,00230, 500000=0,00220 (USD); Supplier 9: Newark; Supplier 10: Digi-Key; Supplier 11: Future Electronics; Supplier 12: Future Electronics; Supplier Part Number 1: RMCF0603FT10K0CT-ND; Supplier Part Number 2: RMCF0603FT10K0DKR-ND; Supplier Part Number 3: RMCF0603FT10K0TR-ND; Supplier Part Number 4: 26AC3219; Supplier Part Number 5: RMCF0603FT10K0; Supplier Part Number 6: 1132596; Supplier Part Number 7: RMCF0603FT10K0; Supplier Part Number 8: 5783949; Supplier Part Number 9: 78Y4027; Supplier Part Number 10: RMCF0603FT10K0-ND; Supplier Part Number 11: RMCF0603FT10K0-CUTT; Supplier Part Number 12: RMCF0603FT10K0-REEL
R9 = Stackpole RMCF0603ZT0R00: Res Thkflm 0603 0 Ohm Jumper 1/10W 100Ppm/ C Smd Rohs Compliant: Yes; Manufacturer: Stackpole Electronics; Power Rating: 100mW; Current Rating: 1A; Working Voltage: 75V; Supplier 1: Digi-Key; Manufacturer Part Number: RMCF0603ZT0R00; RoHS: Yes; Category: Chip SMD Resistors; Stock 1: 1487210; Pricing 1: 1=0,10000, 10=0,01300, 25=0,00960, 50=0,00720, 100=0,00530, 250=0,00404, 500=0,00324, 1000=0,00239 (USD); Mount: Surface Mount; Case/Package: 0603; Case Code (Metric): 1608; Case Code (Imperial): 0603; Contact Plating: Tin,Matte; Min Operating Temperature: -55°C; Max Operating Temperature: 155°C; Packaging: Tape and Reel; Resistor Type: Thick Film; Number of Terminations: 2; Max Power Dissipation: 100mW; Features: Automotive AEC-Q200; Length: 1.55mm; Width: 0.031inch; Height: 0.022inch; Depth: 0.8mm; Radiation Hardening: No; Lead Free: Lead Free; Military Standard: Not; ComponentLink1URL: https://www.seielect.com/catalog/SEI-Packaging.pdf?src-supplier=Avnet; ComponentLink1Description: https://www.seielect.com/catalog/SEI-Packaging.pdf?src-supplier=Avnet; ComponentLink2URL: https://www.seielect.com/catalog/SEI-Packaging.pdf?src-supplier=Verical; ComponentLink2Description: https://www.seielect.com/catalog/SEI-Packaging.pdf?src-supplier=Verical; ComponentLink3URL: https://www.seielect.com/catalog/SEI-Packaging.pdf?src-supplier=Digi-Key; ComponentLink3Description: https://www.seielect.com/catalog/SEI-Packaging.pdf?src-supplier=Digi-Key; ComponentLink4URL: https://www.seielect.com/Catalog/SEI-RMCF_RMCP.pdf?src-supplier=Digi-Key; ComponentLink4Description: https://www.seielect.com/Catalog/SEI-RMCF_RMCP.pdf?src-supplier=Digi-Key; ComponentLink5URL: https://www.seielect.com/catalog/SEI-Packaging.pdf?src-supplier=Arrow+Electronics; ComponentLink5Description: https://www.seielect.com/catalog/SEI-Packaging.pdf?src-supplier=Arrow+Electronics; Supplier 2: Digi-Key; Stock 2: 1487210; Pricing 2: 1=0,10000, 10=0,01300, 25=0,00960, 50=0,00720, 100=0,00530, 250=0,00404, 500=0,00324, 1000=0,00239 (USD); Supplier 3: Digi-Key; Stock 3: 1475000; Pricing 3: 5000=0,00171, 10000=0,00149, 25000=0,00131, 50000=0,00122 (USD); Supplier 4: Newark; Stock 4: 730000; Pricing 4: 1=0,00300, 5000=0,00300, 10000=0,00300 (USD); Supplier 5: Avnet; Stock 5: 730000; Pricing 5: 5000=0,00215, 10000=0,00215, 20000=0,00215, 30000=0,00215, 40000=0,00214 (USD); Supplier 6: Future Electronics; Stock 6: 248827; Pricing 6: 1=0,00390, 50=0,00310, 100=0,00300, 500=0,00270, 1500=0,00250 (USD); Supplier 7: Future Electronics; Stock 7: 245000; Pricing 7: 5000=0,00200, 25000=0,00170, 100000=0,00160, 250000=0,00160, 625000=0,00160 (USD); Supplier 8: Arrow Electronics; Stock 8: 385000; Pricing 8: 5000=0,00180, 10000=0,00160, 1=0,01820, 10=0,00810, 25=0,00660, 100=0,00440, 250=0,00350, 500=0,00310, 1000=0,00250, 3000=0,00220 (USD); Supplier 9: Digi-Key; Supplier 10: Future Electronics; Supplier 11: Future Electronics; Supplier Part Number 1: RMCF0603ZT0R00CT-ND; Supplier Part Number 2: RMCF0603ZT0R00DKR-ND; Supplier Part Number 3: RMCF0603ZT0R00TR-ND; Supplier Part Number 4: 23AC9299; Supplier Part Number 5: RMCF0603ZT0R00; Supplier Part Number 6: 9098835; Supplier Part Number 7: 1874429; Supplier Part Number 8: RMCF0603ZT0R00; Supplier Part Number 9: RMCF0603ZT0R00-ND; Supplier Part Number 10: RMCF0603ZT0R00-REEL; Supplier Part Number 11: RMCF0603ZT0R00-CUTT

## Nets that join several sheets
+1V2_D: Camera-V1_0 (J4.3), Power-V1_0 (C14.1 IC5.5)
+1V05_D: Camera-V1_0 (J4.1), Power-V1_0 (C4.1 IC2.1)
+1V5_D: Camera-V1_0 (J4.5), Power-V1_0 (C20.1 IC8.5)
+1V8_D: Camera-V1_0 (J5.2), Power-V1_0 (C10.1 IC3.5)
+2V7_A: Camera-V1_0 (J3.1), Power-V1_0 (C7.1 IC1.5)
+2V8_A: Camera-V1_0 (J3.3), Power-V1_0 (C12.1 IC4.5)
+2V8_D: Camera-V1_0 (J5.1), Power-V1_0 (C16.1 IC6.5)
+2V9_A: Camera-V1_0 (J3.5), Power-V1_0 (C18.1 IC7.5)
+3V3: Camera-V1_0 (J3.7), Power-V1_0 (21 pins)
+3V3_EXT: Camera-V1_0 (J2.15), Power-V1_0 (FB1.2)
AGND: Camera-V1_0 (J1.6), Power-V1_0 (7 pins)
GND: Camera-V1_0 (18 pins), Power-V1_0 (22 pins)
CAM_PWDN: Camera-V1_0 (J2.11 Q3.D), Power-V1_0 (R9.1)

## Assembly variants
Original: not fitted R1